# Altium schematic sheet Sheet2.SchDoc
size 431 x 279 mm; Organization: ORGANIZATION; Address1: ADDRESS 1; Address2: ADDRESS 2; Address3: ADDRESS 3; Address4: ADDRESS 4; Revision: -; ENG_APP_DATE: --/--/--; DSN_APP_DATE: --/--/--; CHK_APP_DATE: --/--/--
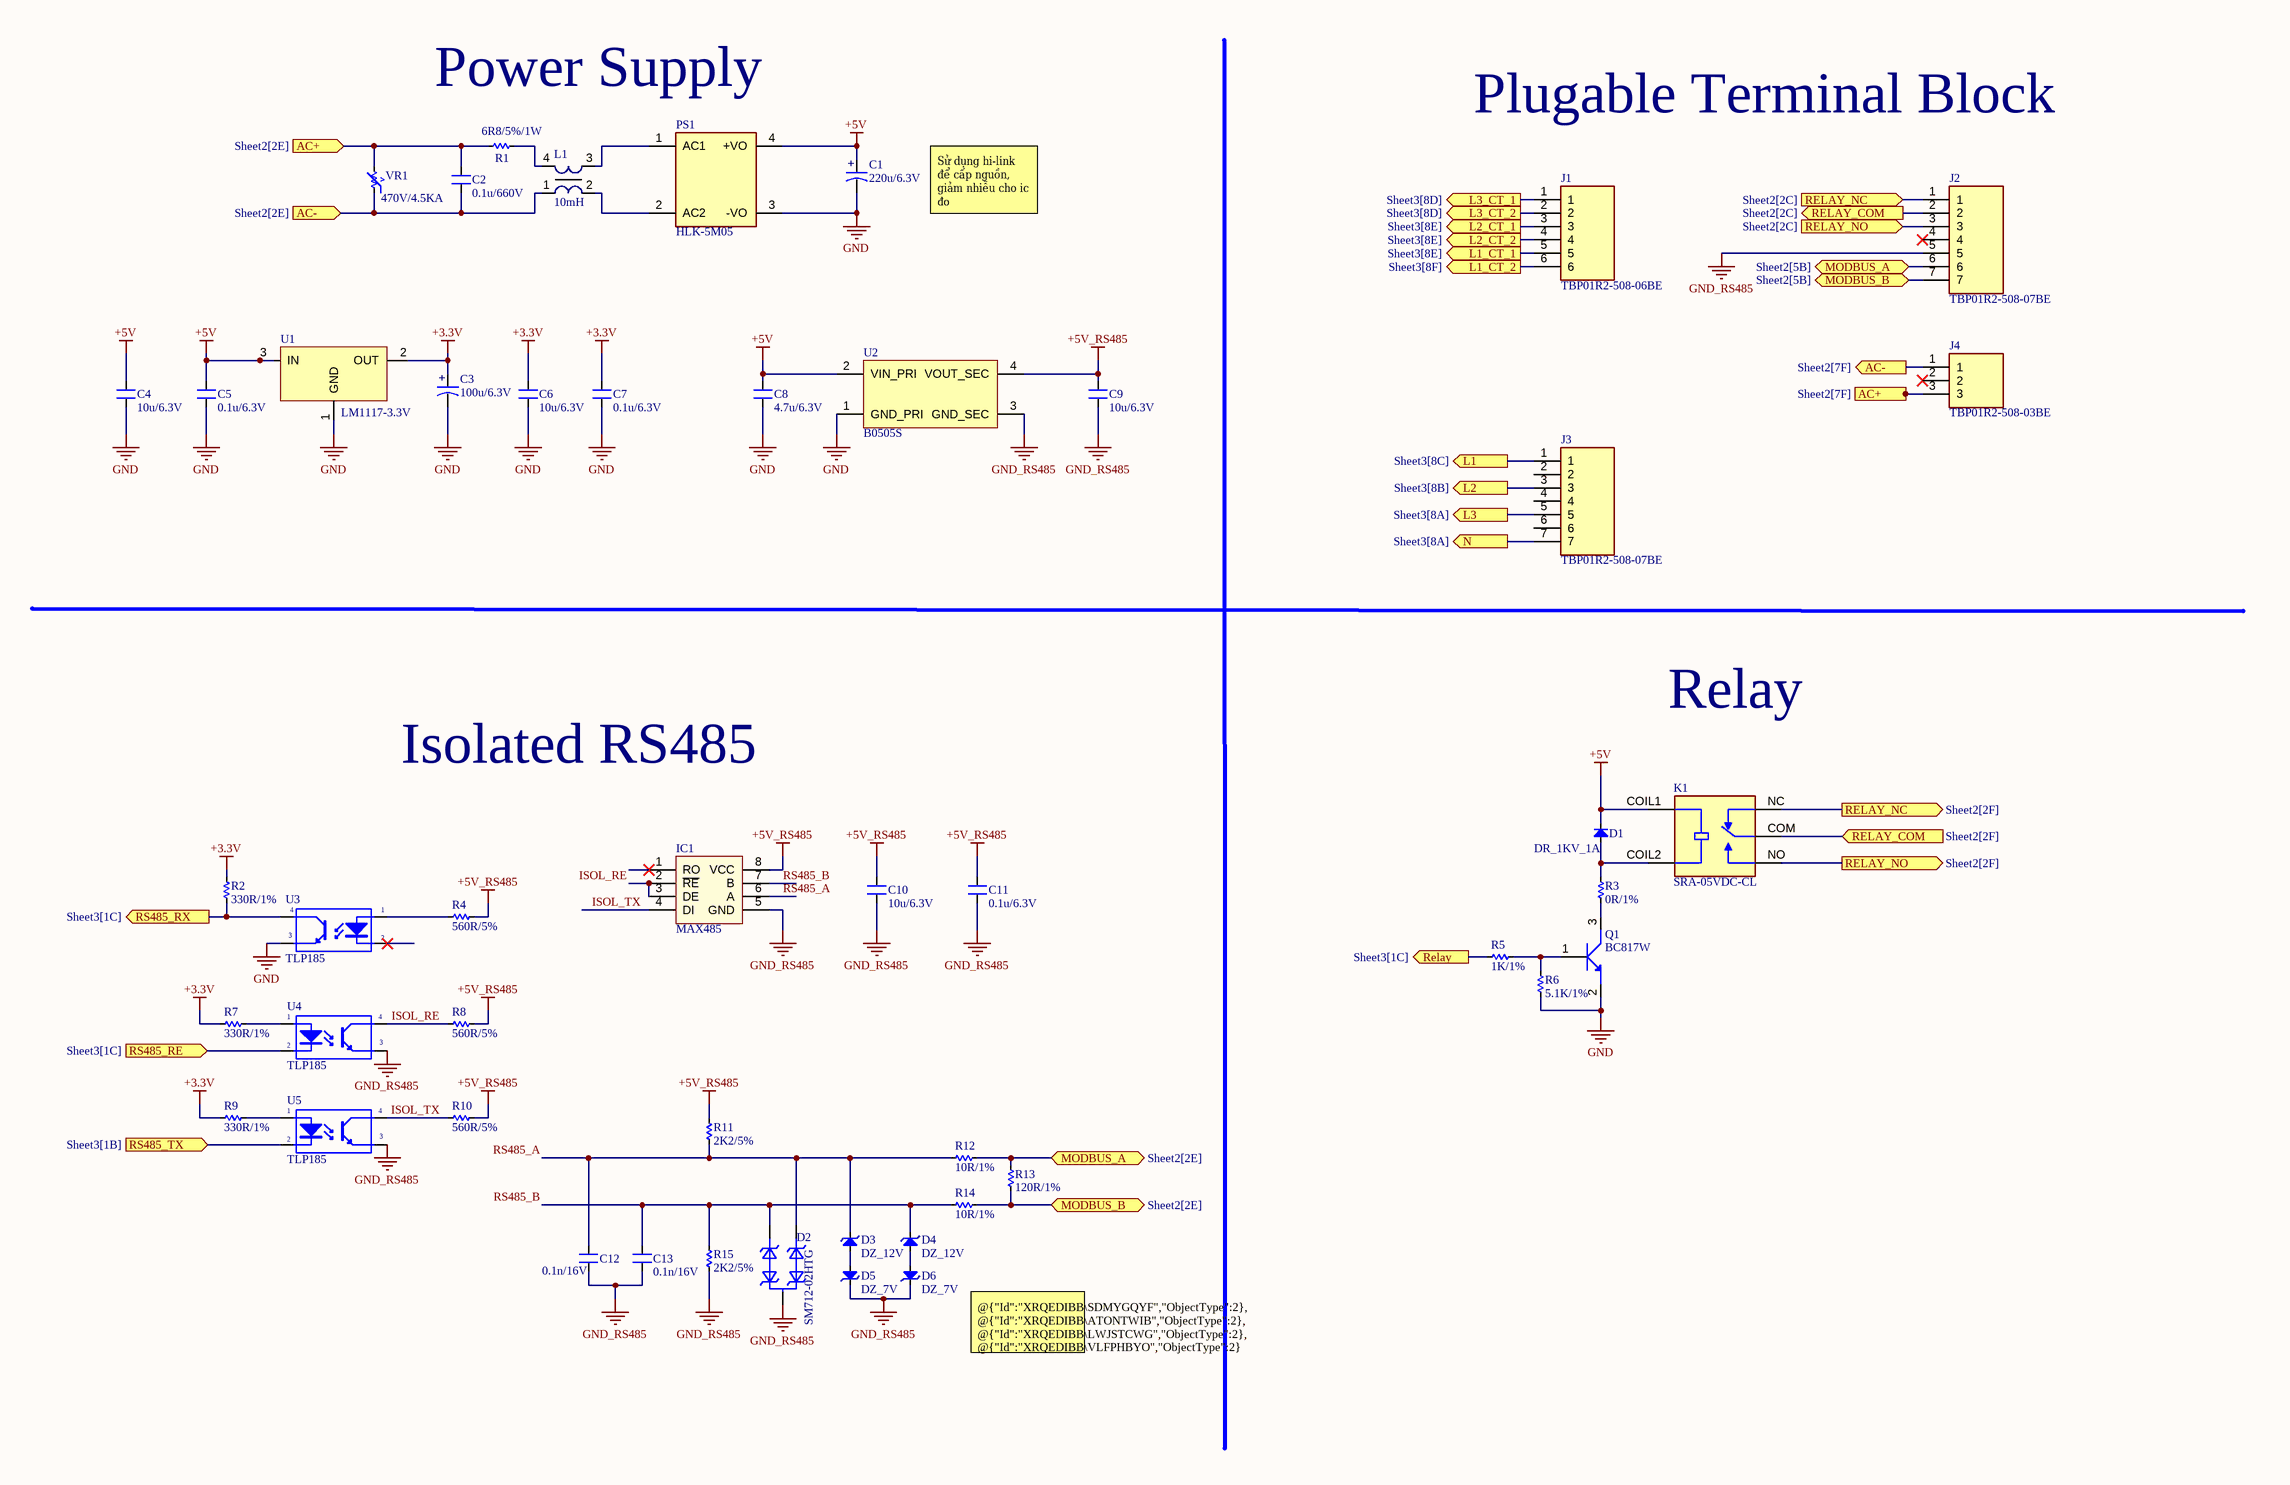
[diagram p0: Sheet2.SchDoc]

## Parts
C1  220u/6.3V  [CAP-ALU-SMD-6.3x7.7x2.2]
C2  0.1u/660V  [CAPRR1500W60L1750T900H1600]
C3  100u/6.3V  [CAP-ALU-SMD-6.3x7.7x2.2]
C4  10u/6.3V  [CAP_C_2012X110]
C5  0.1u/6.3V  [CAP_C_2012X110]
C6  10u/6.3V  [CAP_C_2012X110]
C7  0.1u/6.3V  [CAP_C_2012X110]
C8  4.7u/6.3V  [CAP_C_2012X110]
C9  10u/6.3V  [CAP_C_2012X110]
C10  10u/6.3V  [CAP_C_2012X110]
C11  0.1u/6.3V  [CAP_C_2012X110]
C12  0.1n/16V  [CAP_C_2012X110]
C13  0.1n/16V  [CAP_C_2012X110]
D1  DR_1KV_1A  [DIOM5025X26N]
D2  SM712-02HTG  [SOT95P237X112-3N]
D3  DZ_12V  [LL-34]
D4  DZ_12V  [LL-34]
D5  DZ_7V  [LL-34]
D6  DZ_7V  [LL-34]
IC1  MAX485  [SOIC-8]
J1  TBP01R2-508-06BE  [CUI_TBP01R2-508-06BE]
J2  TBP01R2-508-07BE  [CUI_TBP01R2-508-07BE]
J3  TBP01R2-508-07BE  [CUI_TBP01R2-508-07BE]
J4  TBP01R2-508-03BE  [CUI_TBP01R2-508-03BE]
K1  SRA-05VDC-CL  [RELAY_SRA-05VDC-CL]
L1  10mH  [UU98LFH142LF]
PS1  HLK-5M05  [CONV_HLK-5M05]
Q1  BC817W  [SOT95P237X112-3N]
R1  6R8/5%/1W  [RES-1W]
R2  330R/1%  [RES_C_2012X65]
R3  0R/1%  [RES_C_2012X65]
R4  560R/5%  [RES_C_2012X65]
R5  1K/1%  [RES_C_2012X65]
R6  5.1K/1%  [RES_C_2012X65]
R7  330R/1%  [RES_C_2012X65]
R8  560R/5%  [RES_C_2012X65]
R9  330R/1%  [RES_C_2012X65]
R10  560R/5%  [RES_C_2012X65]
R11  2K2/5%  [RES_C_2012X65]
R12  10R/1%  [RES_C_3216X70]
R13  120R/1%  [RES_C_3216X70]
R14  10R/1%  [RES_C_3216X70]
R15  2K2/5%  [RES_C_2012X65]
U1  LM1117-3.3V  [SOT230P700X180-4N]
U2  B0505S  [B0505S-1W]
U3  TLP185  [SOP254P700X220-4N]
U4  TLP185  [SOP254P700X220-4N]
U5  TLP185  [SOP254P700X220-4N]
VR1  470V/4.5KA  [B72214P2301K101]

## Ports
AC+ (in, see Sheet2[2E]), AC+ (out, see Sheet2[7F]), AC- (in, see Sheet2[2E]), AC- (out, see Sheet2[7F]), L1 (out, see Sheet3[8C]), L1_CT_1 (out, see Sheet3[8E]), L1_CT_2 (out, see Sheet3[8F]), L2 (out, see Sheet3[8B]), L2_CT_1 (out, see Sheet3[8E]), L2_CT_2 (out, see Sheet3[8E]), L3 (out, see Sheet3[8A]), L3_CT_1 (out, see Sheet3[8D]), L3_CT_2 (out, see Sheet3[8D]), MODBUS_A (bidir, see Sheet2[2E]), MODBUS_A (bidir, see Sheet2[5B]), MODBUS_B (bidir, see Sheet2[2E]), MODBUS_B (bidir, see Sheet2[5B]), N (out, see Sheet3[8A]), Relay (out, see Sheet3[1C]), RELAY_COM (in, see Sheet2[2F]), RELAY_COM (out, see Sheet2[2C]), RELAY_NC (in, see Sheet2[2C]), RELAY_NC (out, see Sheet2[2F]), RELAY_NO (in, see Sheet2[2C]), RELAY_NO (out, see Sheet2[2F]), RS485_RE (in, see Sheet3[1C]), RS485_RX (out, see Sheet3[1C]), RS485_TX (in, see Sheet3[1B])

## Nets
+3.3V: C3.1 C6.2 C7.2 R2.1 R7.1 R9.1 U1.2(OUT)
+5V: C1.1 C4.2 C5.2 C8.2 D1.2(K) K1.COIL1 PS1.4(+VO) U1.3(IN) U2.2(VIN_PRI)
+5V_RS485: C9.2 C10.2 C11.2 IC1.8(VCC) R4.2 R8.2 R10.2 R11.2 U2.4(VOUT_SEC)
GND: C1.2 C3.2 C4.1 C5.1 C6.1 C7.1 C8.1 PS1.3(-VO) Q1.2(E) R6.1 U1.1(GND) U2.1(GND_PRI) U3.3(E)
GND_RS485: C9.1 C10.1 C11.1 C12.1 C13.1 D2.3 D5.1(K) D6.1(K) IC1.5(GND) J2.5 R15.1 U2.3(GND_SEC) U4.3(E) U5.3(E)
AC+: C2.2 J4.3 R1.1 VR1.1 ; port AC+
AC-: C2.1 J4.1 L1.1 VR1.2 ; port AC-
ISOL_RE: IC1.2(~{RE}) IC1.3(DE) R8.1 U4.4(C)
ISOL_TX: IC1.4(DI) R10.1 U5.4(C)
L1: J3.1 ; port L1
L1_CT_1: J1.5 ; port L1_CT_1
L1_CT_2: J1.6 ; port L1_CT_2
L2: J3.3 ; port L2
L2_CT_1: J1.3 ; port L2_CT_1
L2_CT_2: J1.4 ; port L2_CT_2
L3: J3.5 ; port L3
L3_CT_1: J1.1 ; port L3_CT_1
L3_CT_2: J1.2 ; port L3_CT_2
MODBUS_A: J2.6 R12.2 R13.2 ; port MODBUS_A
MODBUS_B: J2.7 R13.1 R14.2 ; port MODBUS_B
N: J3.7 ; port N
Relay: R5.1 ; port Relay
RELAY_COM: J2.2 K1.COM ; port RELAY_COM
RELAY_NC: J2.1 K1.NC ; port RELAY_NC
RELAY_NO: J2.3 K1.NO ; port RELAY_NO
RS485_A: C12.2 D2.1 D3.1(K) IC1.6(A) R11.1 R12.1
RS485_B: C13.2 D2.2 D4.1(K) IC1.7(B) R14.1 R15.2
RS485_RE: U4.2(K) ; port RS485_RE
RS485_RX: R2.2 U3.4(C) ; port RS485_RX
RS485_TX: U5.2(K) ; port RS485_TX
NetD1_1: D1.1(A) K1.COIL2 R3.2
NetD3_2: D3.2(A) D5.2(A)
NetD4_2: D4.2(A) D6.2(A)
NetL1_2: L1.2 PS1.2(AC2)
NetL1_3: L1.3 PS1.1(AC1)
NetL1_4: L1.4 R1.2
NetQ1_1: Q1.1(B) R5.2 R6.2
NetQ1_3: Q1.3(C) R3.1
NetR4_1: R4.1 U3.1(A)
NetR7_2: R7.2 U4.1(A)
NetR9_2: R9.2 U5.1(A)

Not connected (* = marked no-connect by the designer): IC1 1(RO)*; J2 4*; J3 2 4 6; J4 2*; U3 2(K)*

## Notes on the sheet
- Power Supply
- Plugable Terminal Block
- Sử dụng hi-link để cấp nguồn, giảm nhiễu cho ic đo
- Relay
- Isolated RS485
- @{"Id":"XRQEDIBB\SDMYGQYF","ObjectType":2}, @{"Id":"XRQEDIBB\ATONTWIB","ObjectType":2}, @{"Id":"XRQEDIBB\LWJSTCWG","ObjectType":2}, @{"Id":"XRQEDIBB\VLFPHBYO","ObjectType":2} placeholder LL-34 zener
- (in symbol CAP_POLAR) +

## Library data of the parts
C1 C3 = CAP_POLAR
C2 C4-C13 = CAP_SMD
D1 = Diode: Default Diode; Code - JEDEC: DO-214-AB; Value: 1N5007; Published: 8-Jun-2000; Revision: July-2002: Re-released for DXP Platform.; Publisher: Altium Limited
D2 = SM712-02HTG: TVS Diode, SM712 Series, 31V Clamp, 600W Peak Pulse, Surface Mount, SOT23-3 | Littelfuse SM712-02HTG; MF: Littelfuse Inc.; SnapEDA_Link: https://www.snapeda.com/parts/SM712-02HTG/Littelfuse/view-part/?ref=snap; Package: SOT-23 Littelfuse Inc.; Value: *; MP: SM712-02HTG; Check_prices: https://www.snapeda.com/parts/SM712-02HTG/Littelfuse/view-part/?ref=eda
D3-D6 = DIODE Zener: Zenner
IC1 = MAX485: RS232 - RS485 (Same sn75176)
J1 = TBP01R2-508-06BE: 2~24 Ð¿Ð¾Ð»ÑŽÑÐ°, Ð¿Ð¾Ð´ÐºÐ»ÑŽÑ‡Ð°ÐµÐ¼Ñ‹Ð¹, Ð²ÐµÑ€Ñ‚Ð¸ÐºÐ°Ð»ÑŒÐ½Ñ‹Ð¹, ÑˆÐ°Ð³ 5,08, ÐºÐ»ÐµÐ¼Ð¼Ð½Ñ‹Ð¹ Ð±Ð»Ð¾Ðº; MF: Same Sky; SnapEDA_Link: https://www.snapeda.com/parts/TBP01R2-508-06BE/Same+Sky/view-part/?ref=snap; Package: None; Value: *; MP: TBP01R2-508-06BE; Check_prices: https://www.snapeda.com/parts/TBP01R2-508-06BE/Same+Sky/view-part/?ref=eda
J2 J3 = TBP01R2-508-07BE: 2~24 Poles, Pluggable, Receptacle, Vertical, 5.08 Pitch, Terminal Block Connector; MF: Same Sky; SnapEDA_Link: https://www.snapeda.com/parts/TBP01R2-508-07BE/Same+Sky/view-part/?ref=snap; Package: None; Value: *; MP: TBP01R2-508-07BE; Check_prices: https://www.snapeda.com/parts/TBP01R2-508-07BE/Same+Sky/view-part/?ref=eda
J4 = TBP01R2-508-03BE: 2~24 Poles, Pluggable, Receptacle, Vertical, 5.08 Pitch, Terminal Block Connector; MF: Same Sky; SnapEDA_Link: https://www.snapeda.com/parts/TBP01R2-508-03BE/Same+Sky/view-part/?ref=snap; Package: None; Value: *; MP: TBP01R2-508-03BE; Check_prices: https://www.snapeda.com/parts/TBP01R2-508-03BE/Same+Sky/view-part/?ref=eda
K1 = SRA-05VDC-CL: MF: Songle Relay; SnapEDA_Link: https://www.snapeda.com/parts/SRA-05VDC-CL/Songle+Relay/view-part/?ref=snap; Package: Package; Value: *; MP: SRA-05VDC-CL; Check_prices: https://www.snapeda.com/parts/SRA-05VDC-CL/Songle+Relay/view-part/?ref=eda
L1 = L-DIP-2: partNo: 744284100; Manufacturer: Würth Elektronik eiSos GmbH; Inductance: 10mH; ComponentLink1Description: Manufacturer; ComponentLink1URL: http://www.we-online.de; Created by: Christin Zierenner; Created Date: March 2012; ComponentLink2Description: Datasheet; ComponentLink2URL: http://www.we-online.de/katalog/media/pdf/744284100.pdf
PS1 = HLK-5M05: AC DC 220V to 5V 5W 5Watt Isolated Switching Step-Down Power Supply Module Converter; MF: Hi-link; Check_prices: https://www.snapeda.com/parts/HLK-5M05/Hi-link/view-part/?ref=eda; SnapEDA_Link: https://www.snapeda.com/parts/HLK-5M05/Hi-link/view-part/?ref=snap; Price: None; Availability: Not in stock; Package: Package; MP: HLK-5M05; Value: *
Q1 = BJT_NPN: LCSC Part #: *
R1-R15 = Res-SMD: Resistor; Manufacturer: Generic Components; Class: Passive; Published: 08/06/2000; Publisher: Altium Hobart Technology Centre
U1 = LM1117: 800mA Low-Dropout Linear Regulator; Creator: Nguyen Ba Bien; Website: http://group3i.net
U3-U5 = TLP185: Single Opto; Value: PC817
VR1 = Varistor: MOV-14D471K, Varistors 470V 14mm
U2 = B0505S: LCSC Part #: *